# EAGLE design Adafruit 128x64 Mono OLED PCB (EAGLE 9.6.2)
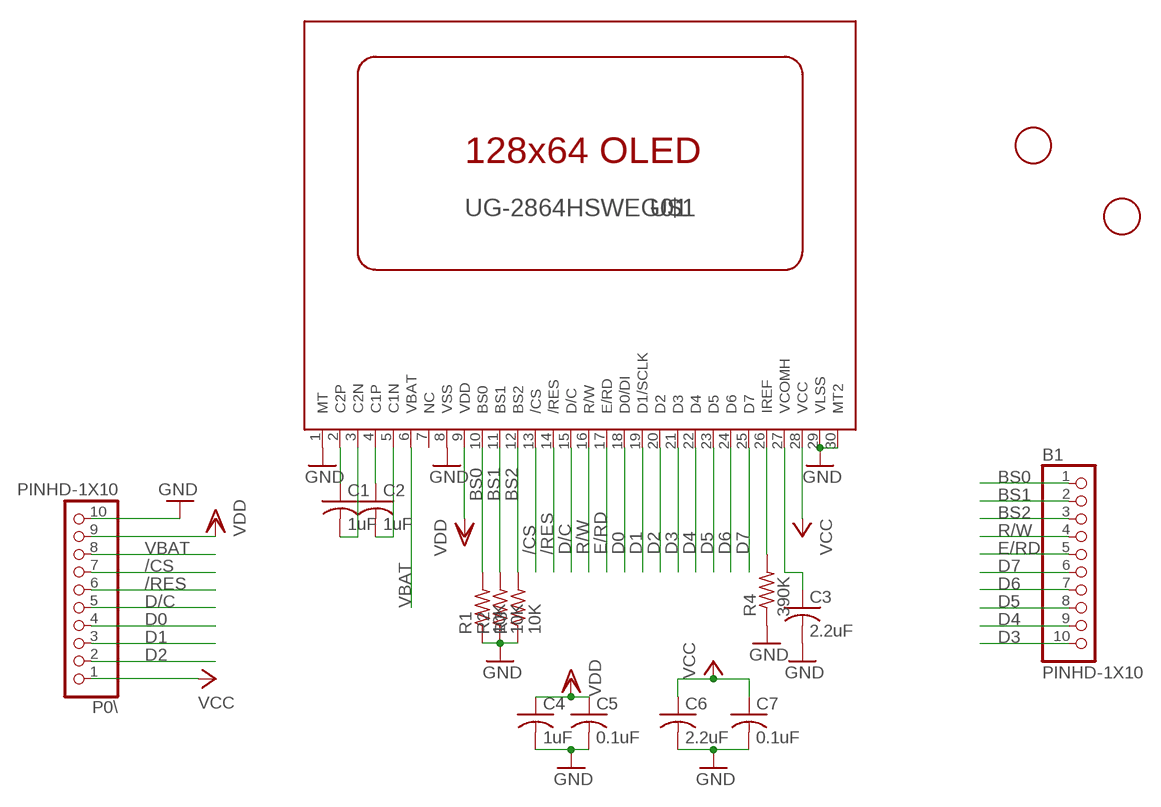
[diagram p0: schematic, sheet 1]

## Parts
B1  PINHD-1X10  [1X10-BIG]
C1  1uF  C-USC0805K  [C0805K]
C2  1uF  C-USC0805K  [C0805K]
C3  2.2uF  C-USC0805K  [C0805K]
C4  1uF  C-USC0805K  [C0805K]
C5  0.1uF  C-USC0805K  [C0805K]
C6  2.2uF  C-USC0805K  [C0805K]
C7  0.1uF  C-USC0805K  [C0805K]
P0\  PINHD-1X10  [1X10-BIG]
R1  10K  R-US_R0805  [R0805]
R2  10K  R-US_R0805  [R0805]
R3  10K  R-US_R0805  [R0805]
R4  390K  R-US_R0805  [R0805]
U$1  UG-2864HSWEG01  [1X30-0.7MM]
U$3  FIDUCIAL  [FIDUCIAL_1MM]
U$4  FIDUCIAL  [FIDUCIAL_1MM]

## Nets
/CS: P0\.7 U$1.13(/CS)
/RES: P0\.6 U$1.14(/RES)
BS0: B1.1 R1.2 U$1.10(BS0)
BS1: B1.2 R2.2 U$1.11(BS1)
BS2: B1.3 R3.2 U$1.12(BS2)
D0: P0\.4 U$1.18(D0/DI)
D1: P0\.3 U$1.19(D1/SCLK)
D2: P0\.2 U$1.20(D2)
D3: B1.10 U$1.21(D3)
D4: B1.9 U$1.22(D4)
D5: B1.8 U$1.23(D5)
D6: B1.7 U$1.24(D6)
D7: B1.6 U$1.25(D7)
D/C: P0\.5 U$1.15(D/C)
E/RD: B1.5 U$1.17(E/RD)
GND: C3.2 C4.2 C5.2 C6.2 C7.2 P0\.10 R1.1 R2.1 R3.1 R4.1 U$1.1(MT) U$1.8(VSS) U$1.29(VLSS) U$1.30(MT2)
N$4: C1.2 U$1.3(C2N)
N$5: C1.1 U$1.2(C2P)
N$6: C2.1 U$1.4(C1P)
N$7: C2.2 U$1.5(C1N)
N$8: R4.2 U$1.26(IREF)
N$13: C3.1 U$1.27(VCOMH)
R/W: B1.4 U$1.16(R/W)
VBAT: P0\.8 U$1.6(VBAT)
VCC: C6.1 C7.1 P0\.1 U$1.28(VCC)
VDD: C4.1 C5.1 P0\.9 U$1.9(VDD)
Unconnected: U$1.7(NC)

## Library data of the parts
B1 P0\ = adafruit:PINHD-1X10: Pin header 1x10 0.1" spacing With round pins
C1-C7 = adafruit:C-US: CAPACITOR, American symbol
R1-R4 = adafruit:R-US_: RESISTOR, American symbol
U$1 = adafruit:UG-2864HSWEG01: UG-2864HSWEG01 OLED display
U$3 U$4 = adafruit:FIDUCIAL: For use by pick and place machines to calibrate the vision/machine, 1mm By microbuilder.eu

## Board
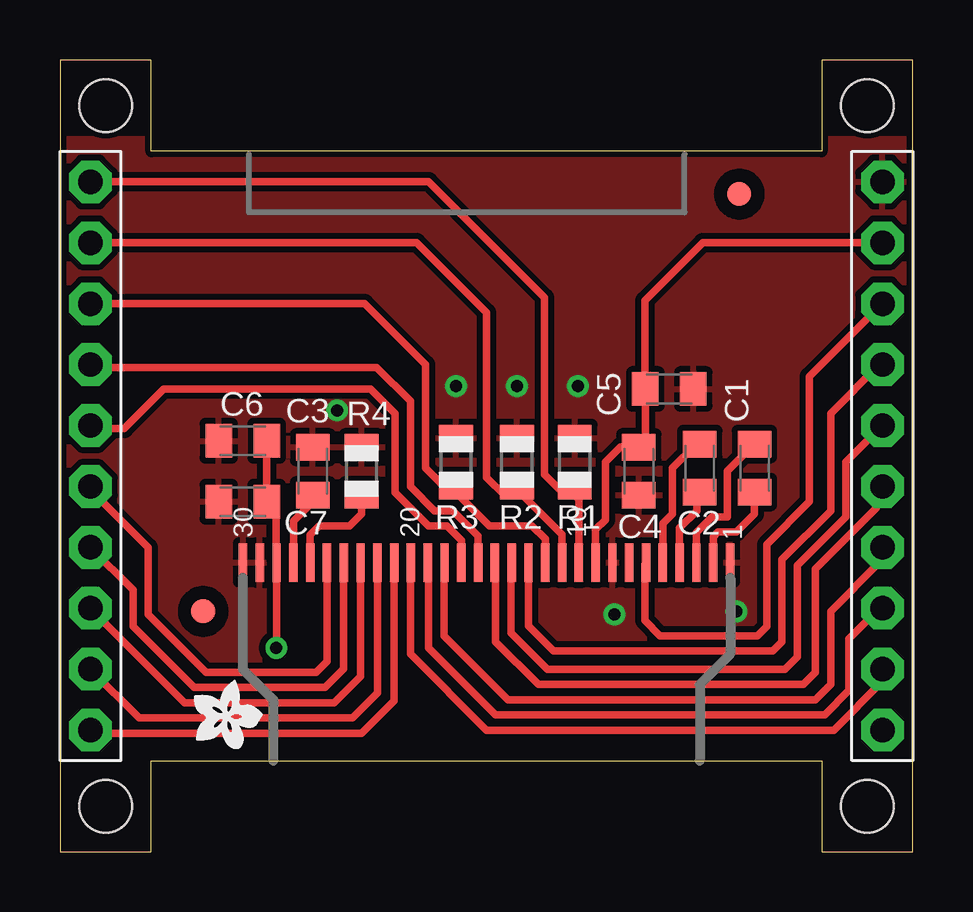
[diagram p1: board, top side]
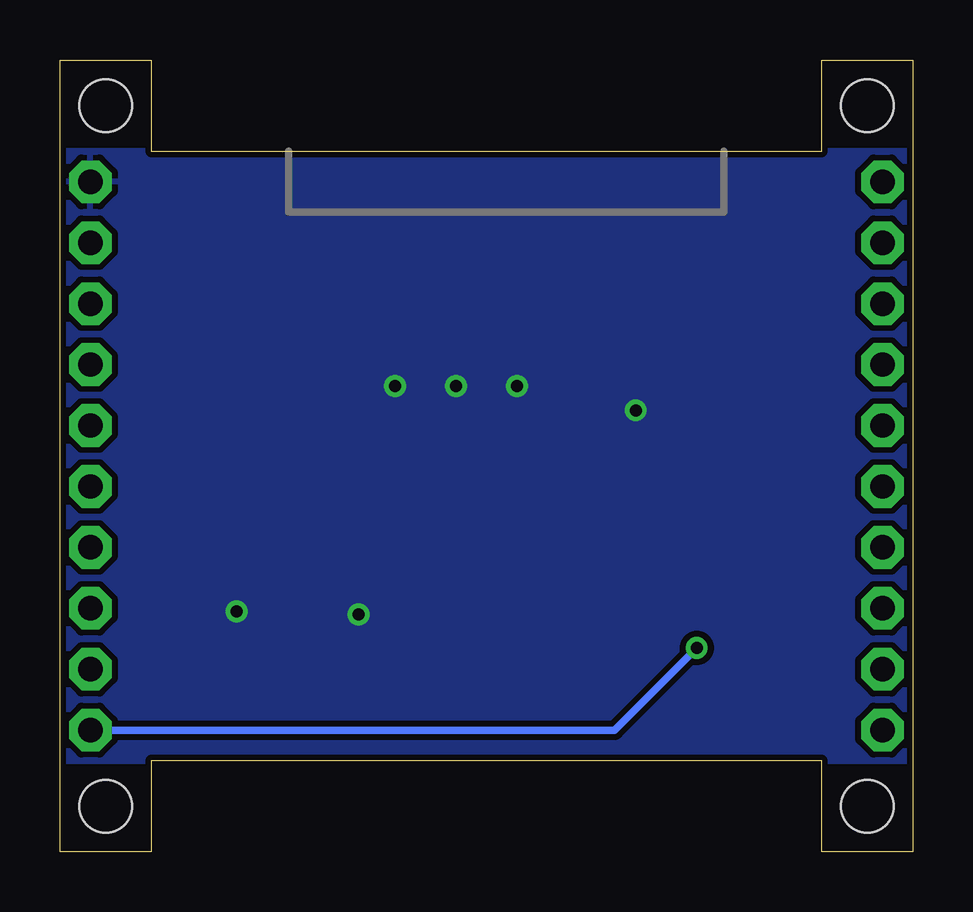
[diagram p2: board, bottom side, seen from below]

Size 35.56 x 33.02 mm. Coordinates in mm from the lower left corner, seen from the top.
Outline: 0,0 3.81,0 3.81,3.81 31.75,3.81 31.75,0 35.56,0 35.56,33.02 31.75,33.02 31.75,29.21 3.81,29.21 3.81,33.02 0,33.02 0,0
Copper layers (1*16): Top 0.035mm / dielectric 1.5mm / Bottom 0.035mm
Design rules "default *": minimum track width 10mil, minimum drill 19mil, track to track 10mil, track to pad 10mil, pad to pad 10mil, via to via 10mil, smd to smd 10mil, copper to edge 10mil, drill to drill 8mil, minimum pad ring 10mil, minimum via ring 8mil, stop-mask expansion 4mil, vias tented up to drill 20mil, thermal gap 10mil
Holes 2.2 mm at 1.91,1.91 33.66,1.91 1.91,31.11 33.66,31.11
bKeepout: area 4.4,5.7 to 31.4,25.3

### Footprints (pad centres in the part's own frame; a part is rotated, then mirrored left to right if it is on the bottom)
1X10-BIG = drill 1.016 pad 1.778 octagon: 1 -11.43,0; 2 -8.89,0; 3 -6.35,0; 4 -3.81,0; 5 -1.27,0; 6 1.27,0; 7 3.81,0; 8 6.35,0; 9 8.89,0; 10 11.43,0
C0805K = smd 1.1 x 1.4: 1 -1,0; 2 1,0
R0805 = smd 1.1 x 1.4: 1 -1,0; 2 1,0
1X30-0.7MM = smd 0.35 x 1.6: 1 -10.15,0; 2 -9.45,0; 3 -8.75,0; 4 -8.05,0; 5 -7.35,0; 6 -6.65,0; 7 -5.95,0; 8 -5.25,0; 9 -4.55,0; 10 -3.85,0; 11 -3.15,0; 12 -2.45,0; 13 -1.75,0; 14 -1.05,0; 15 -0.35,0; 16 0.35,0; 17 1.05,0; 18 1.75,0; 19 2.45,0; 20 3.15,0; 21 3.85,0; 22 4.55,0; 23 5.25,0; 24 5.95,0; 25 6.65,0; 26 7.35,0; 27 8.05,0; 28 8.75,0; 29 9.45,0; 30 10.15,0
FIDUCIAL_1MM = smd 1 x 1: 1 0,0

### Placement (x,y rotation side)
B1  1.27,16.51 270 top
C1  28.96,16 90 top
C2  26.67,16 90 top
C3  10.54,15.88 90 top
C4  24.13,15.88 270 top
C5  25.4,19.3 0 top
C6  7.62,17.14 180 top
C7  7.62,14.61 180 top
P0\  34.29,16.51 90 top
R1  21.46,16.26 270 top
R2  19.05,16.26 270 top
R3  16.51,16.26 270 top
R4  12.57,15.88 270 top
U$1  17.78,12.07 180 top
U$2  [ADAFRUIT200MIL]  6.99,5.84 270 top
U$3  28.32,27.43 0 top
U$4  5.97,10.03 0 top

### Tracks (layer width: path | path; a pad name or v marks a point on that pad's centre or on a via)
/CS
  Top 0.305: U$1.13 19.53,9.43 20.57,8.38 29.72,8.38 30.1,8.76 30.1,12.19 32.13,14.22 32.13,18.29 34.16,20.32 P0\.7
/RES
  Top 0.305: P0\.6 32.77,16.26 32.77,13.97 30.73,11.94 30.73,8.13 30.23,7.62 20.32,7.62 18.8,9.14 18.8,12.03 U$1.14
BS0
  Top 0.305: U$1.10 21.63,14.69 21.46,14.86 | B1.1 15.37,27.94 20.19,23.11 20.19,15.75 21.08,14.86 21.46,14.86 | 21.46,14.86 21.48,14.86 | 21.48,14.86 21.59,14.86 | 21.46,15.37 R1.2 21.46,15.24 | 21.46,14.86 21.46,15.24 | 21.48,14.86 21.46,14.88 21.46,15.24
BS1
  Top 0.305: U$1.11 20.93,13.23 19.05,15.11 19.05,15.24 | B1.2 14.86,25.4 17.78,22.48 17.78,15.62 18.54,14.86 19.18,14.86 19.05,14.99 19.05,15.24 | 19.05,15.24 R2.2
BS2
  Top 0.305: U$1.12 20.23,13.04 19.68,13.59 17.91,13.59 16.51,14.99 | B1.3 12.7,22.86 15.24,20.32 15.24,16 16.38,14.86 16.51,14.99 | R3.2 16.51,15.24 16.51,14.99
D0
  Top 0.305: 16,12.09 16,12.19 | 16,12.09 U$1.18 | 16,12.09 16,9.02 18.67,6.35 31.5,6.35 32.13,6.98 32.13,10.03 34.16,12.07 34.16,12.45 34.29,12.57 P0\.4
D1
  Top 0.305: U$1.19 15.37,12.07 15.37,8.51 18.16,5.71 31.88,5.71 32.89,6.73 32.89,8.89 34.16,10.16 P0\.3 | P0\.3 34.29,10.29 | P0\.3 34.29,10.03 | P0\.3 34.42,10.16
D2
  Top 0.305: U$1.20 14.61,12.07 14.61,8.26 17.78,5.08 32.26,5.08 34.29,7.11 P0\.2
D3
  Top 0.305: U$1.21 13.93,6.31 12.57,4.95 1.65,4.95 1.52,5.08 B1.10
D4
  Top 0.305: U$1.22 13.23,6.63 12.19,5.59 3.3,5.59 B1.9
D5
  Top 0.305: U$1.23 12.53,7.32 11.43,6.22 5.21,6.22 B1.8
D6
  Top 0.305: U$1.24 11.83,7.64 11.05,6.86 5.59,6.86 3.05,9.4 3.05,10.92 B1.7
D7
  Top 0.305: U$1.25 11.13,7.96 10.67,7.49 6.1,7.49 3.68,9.91 3.68,12.7 1.27,15.11 B1.6
D/C
  Top 0.305: U$1.15 18.16,12.07 18.16,8.76 19.94,6.98 30.99,6.98 31.5,7.49 31.5,11.81 34.04,14.35 34.04,15.11 34.29,15.37 P0\.5
E/RD
  Top 0.305: U$1.17 16.73,12.99 16.13,13.59 15.37,13.59 13.97,14.99 13.97,18.29 12.95,19.3 4.32,19.3 2.67,17.65 1.78,17.65 1.52,17.91 1.4,17.78 B1.5
GND  (via drill 0.5)
  other vias: 16.51,19.43 19.05,19.43 21.59,19.43 23.11,9.91 11.56,18.41 28.19,10.03
  pour Top: -0.25,29.72 -0.25,3.43 36.07,3.43 36.07,29.72
  pour Bottom: 0,3.81 0,29.21 35.56,29.21 35.56,3.81
N$4
  Top 0.305: U$1.3 26.53,13.32 27.18,13.97 27.81,13.97 27.81,15.88 28.96,17.02 C1.2
N$5
  Top 0.305: U$1.2 27.23,13.13 27.43,13.34 28.19,13.34 28.96,14.1 C1.1 28.96,15.11
N$6
  Top 0.305: U$1.4 25.83,13.51 26.54,14.22 26.54,14.86 26.67,14.99 C2.1
N$7
  Top 0.305: U$1.5 25.13,13.7 25.53,14.1 25.53,16 26.54,17.02 26.56,17 C2.2
N$8
  Top 0.305: U$1.26 10.43,13.22 10.79,13.59 12.06,13.59 12.57,14.1 R4.2
N$13
  Top 0.305: U$1.27 9.73,13.79 10.73,14.8 | 10.73,14.8 10.79,14.86 | 10.73,14.8 10.54,14.99 C3.1
R/W
  Top 0.305: U$1.16 17.43,13.18 16.38,14.22 15.62,14.22 14.61,15.24 14.61,18.8 13.21,20.19 1.27,20.19 B1.4
VBAT
  Top 0.305: P0\.8 31.24,19.81 31.24,14.61 29.46,12.83 29.46,9.4 29.08,9.02 25.02,9.02 24.38,9.65 24.38,12.02 U$1.6
VCC  (via drill 0.5)
  Top 0.305: C6.1 8.51,17.14 8.62,17.03 C7.1 8.62,14.84 8.64,14.86 9.02,14.48 9.02,12.19 9.03,12.18 U$1.28 9.03,8.52 v9.02,8.51
  Bottom 0.305: v9.02,8.51 12.45,5.08 P0\.1
VDD
  Top 0.305: P0\.9 26.8,25.4 24.38,22.99 24.38,19.05 24.4,19.07 C5.1 24.4,17.29 24.13,17.02 C4.1 24.13,16.89 24,17.02 23.88,16.89 23.37,16.89 22.73,16.26 22.73,13.84 22.33,13.44 U$1.9

### Text on the board
tDocu: BS0 | GND | SSD1306 OLED | BS1 | For internal booster | VDD | BS2 | Vdd=3v Vbat=3-4v Vcc=N/C | For external OLED supply | VBAT | R/W | Vdd=3v Vbat=Vdd Vcc=7-9v | CS | ERD | RES | D7 | D/C | D6 | Clk | D5 | D0 | Data | D1 | D4 | D2 | D3 | VCC | VCC
bDocu: BS0 | GND | SSD1306 OLED | BS1 | For internal booster | VDD | BS2 | Vdd=3v Vbat=3-4v Vcc=N/C | For external OLED supply | VBAT | R/W | Vdd=3v Vbat=Vdd Vcc=7-9v | CS | ERD | RES | D7 | D/C | D6 | Clk | D5 | D0 | Data | D4 | D1 | D2 | D3 | VCC